# EAGLE schematic BlueBus (EAGLE 9.6.2)

## Sheet 1 of 5
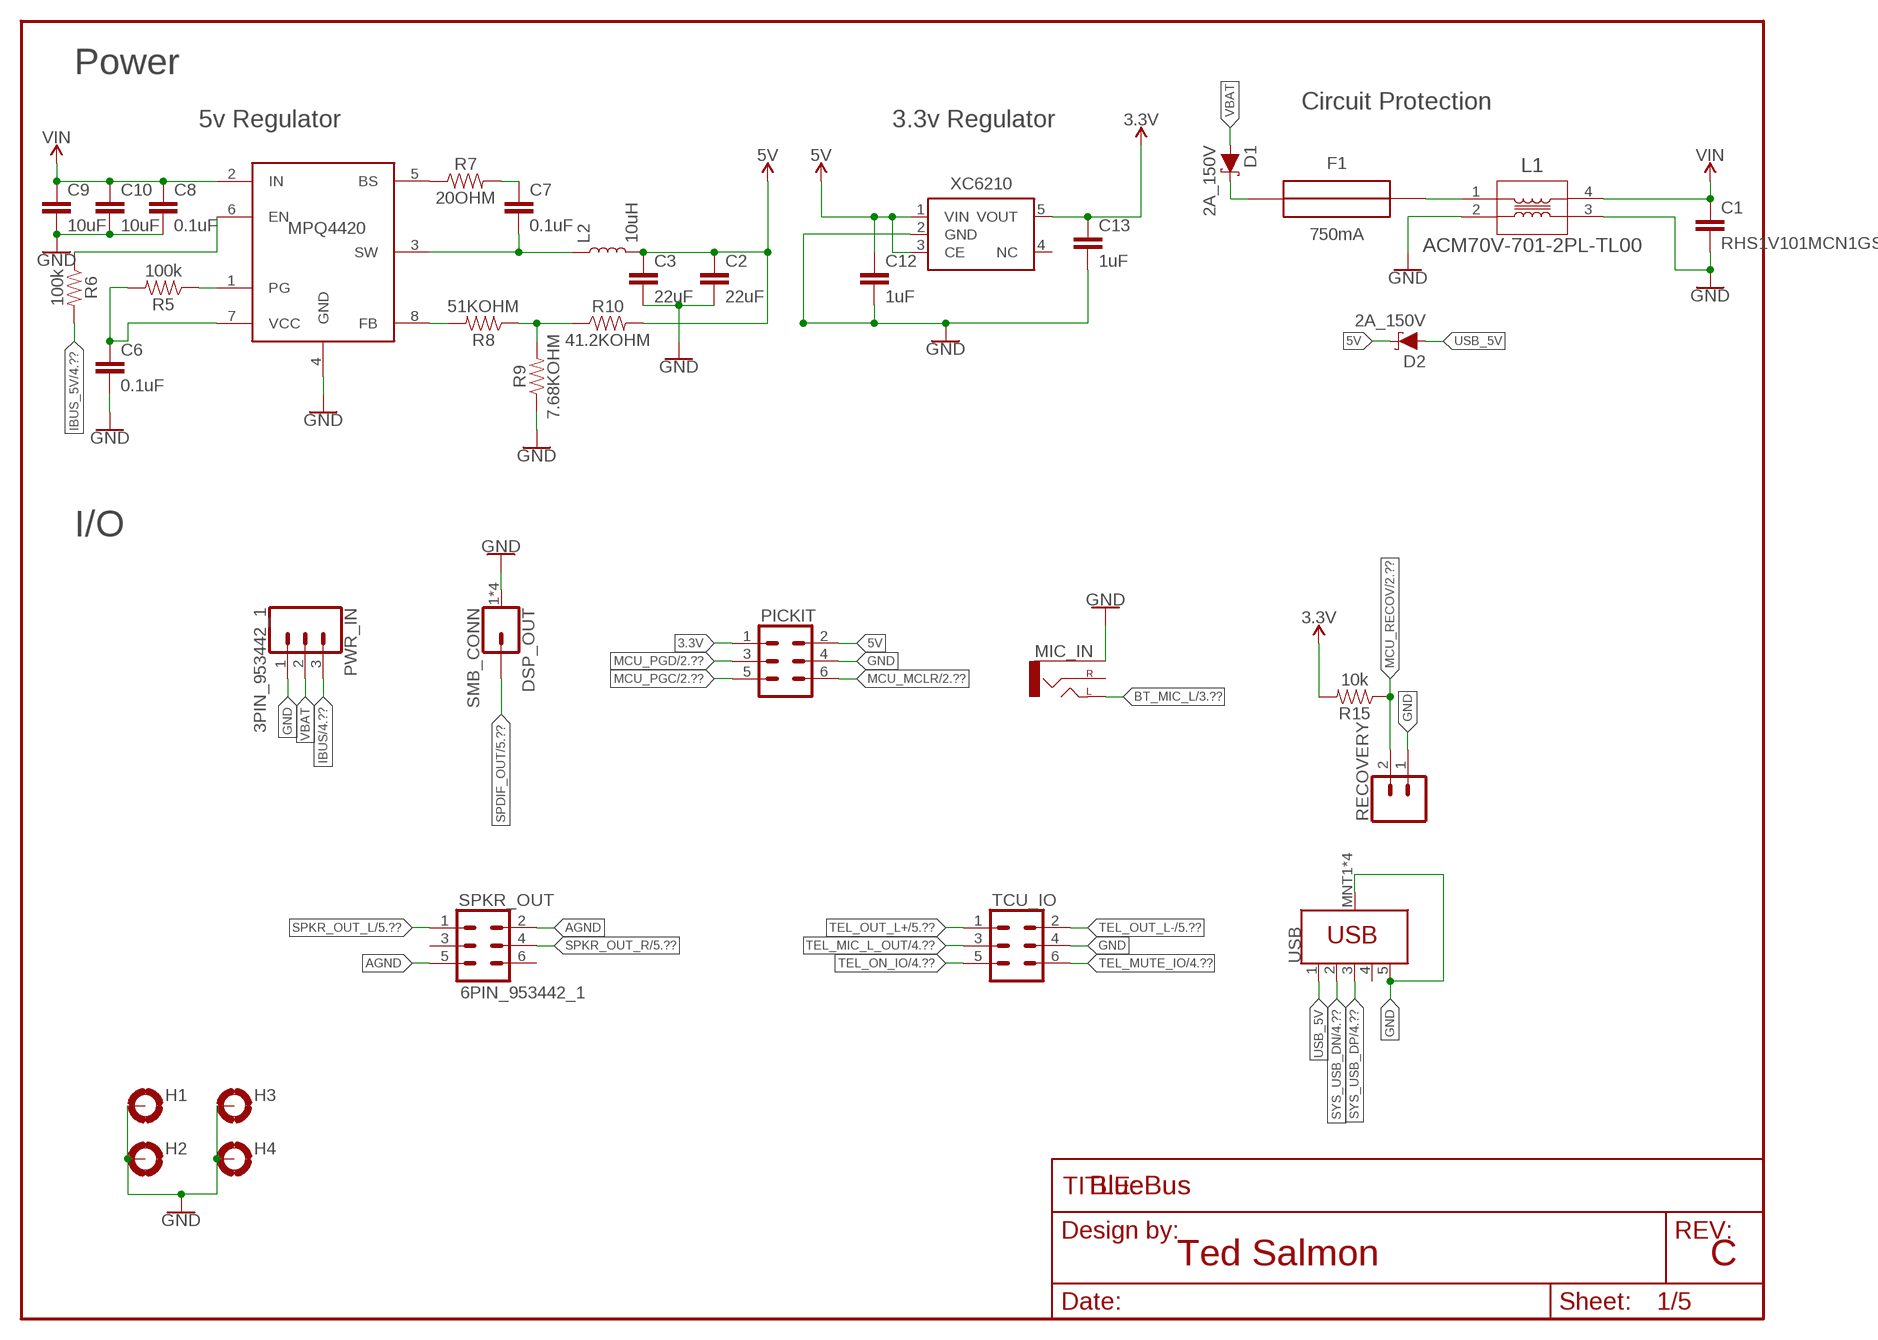
[diagram p0: schematic, sheet 1]

### Parts
C1  RHS1V101MCN1GS  [RHS1V101MCN1GS]
C2  22uF  22UF  [0805]
C3  22uF  22UF  [0805]
C6  0.1uF  0.1UF  [0805]
C7  0.1uF  0.1UF  [0805]
C8  0.1uF  0.1UF  [0805]
C9  10uF  10UF  [1206]
C10  10uF  10UF  [1206]
C12  1uF  1UF  [0805]
C13  1uF  1UF  [0805]
D1  2A_150V  SMD2150PL_2A_150V  [SOD123FL-2]
D2  2A_150V  SMD2150PL_2A_150V  [SOD123FL-2]
DSP_OUT  SMB_CONN  [MOLEX_SMB]
F1  750mA  LITTLEBLOCK_FUSE_.75A  [LITTLEFUSE]
FRAME1  FRAME-LETTER  [DUMMY]
H1  2,2-PAD  [2.2-PAD]
H2  2,2-PAD  [2.2-PAD]
H3  2,2-PAD  [2.2-PAD]
H4  2,2-PAD  [2.2-PAD]
L1  ACM70V-701-2PL-TL00  [ACM70V-701-2PL-TL00]
L2  10uH  MPL-SE5040-100  [MPL-SE5040]
MIC_IN  AUDIO-CUI-SJ-3523-SMT  [AUDIO-CUI-SJ-352X-SMT]
MPQ4420  MPQ4420  [TSOT23-8]
PICKIT  6PIN_JUMPER  [2X3]
PWR_IN  3PIN_953442_1  [TE_MQS_3PIN]
R5  100k  100KOHM  [0805]
R6  100k  100KOHM  [0805]
R7  20OHM  [0805]
R8  51KOHM  [0805]
R9  7.68KOHM  [0805]
R10  41.2KOHM  [0805]
R15  10k  10KOHM  [0805]
RECOVERY  2PIN_JUMPER  [1X02]
SPKR_OUT  6PIN_953442_1  [TE_MQS_6PIN]
TCU_IO  6PIN_5_103166_1  [TE_AMPMODU_6_PIN]
USB  USB3080-30-01-A  [USB3080-30-01-A]
XC6210  XC6210SOT25  [SOT23-5]

### Nets
3.3V [3.3V]: C13.1 PICKIT.1 R15.2 XC6210.5(VOUT) ; also sheet 2,3,4,5
5V [USB_5V]: C2.1 C3.1 C12.1 D2.C L2.2 PICKIT.2 R10.2 XC6210.1(VIN) XC6210.3(CE) ; also sheet 4,5
5VREG_BS: MPQ4420.5(BS) R7.1
5VREG_BS_CAP: C7.1 R7.2
5VREG_EN: MPQ4420.6(EN) R6.1
5VREG_FB: MPQ4420.8(FB) R8.2
5VREG_FB_T: R8.1 R9.2 R10.1
5VREG_PG: MPQ4420.1(PG) R5.1
5VREG_SW: C7.2 L2.1 MPQ4420.3(SW)
5VREG_VCC: C6.1 MPQ4420.7(VCC) R5.2
AGND: SPKR_OUT.2 SPKR_OUT.5 ; also sheet 5
BT_MIC_L: MIC_IN.TIP(LEFT) ; also sheet 3,4
GND: C1.2 C2.2 C3.2 C6.2 C8.2 C9.2 C10.2 C12.2 C13.2 DSP_OUT.1(GND) DSP_OUT.2(GND) DSP_OUT.3(GND) DSP_OUT.4(GND) H1.B2.2(MOUNT) H2.B2.2(MOUNT) H3.B2.2(MOUNT) H4.B2.2(MOUNT) L1.2 L1.3 MIC_IN.SLEEVE MPQ4420.4(GND) PICKIT.4 PWR_IN.1 R9.1 RECOVERY.1 TCU_IO.4 USB.5(GND) USB.MNT1(SHIELD) USB.MNT2(SHIELD) USB.MNT3(SHIELD) USB.MNT4(SHIELD) XC6210.2(GND) ; also sheet 2,3,4,5
IBUS [Data]: PWR_IN.3 ; also sheet 4
IBUS_5V: R6.2 ; also sheet 4
MCU_MCLR [MCU_Data]: PICKIT.6 ; also sheet 2
MCU_PGC [MCU_Data]: PICKIT.5 ; also sheet 2
MCU_PGD [MCU_Data]: PICKIT.3 ; also sheet 2
MCU_RECOV [MCU_Data]: R15.1 RECOVERY.2 ; also sheet 2
SPDIF_OUT: DSP_OUT.P$1 ; also sheet 5
SPKR_OUT_L: SPKR_OUT.1 ; also sheet 5
SPKR_OUT_R: SPKR_OUT.4 ; also sheet 5
SYS_USB_DN [Data]: USB.2(D-) ; also sheet 4
SYS_USB_DP [Data]: USB.3(D+) ; also sheet 4
TEL_MIC_L_OUT: TCU_IO.3 ; also sheet 4
TEL_MUTE_IO: TCU_IO.6 ; also sheet 4
TEL_ON_IO: TCU_IO.5 ; also sheet 4
TEL_OUT_L+: TCU_IO.1 ; also sheet 5
TEL_OUT_L-: TCU_IO.2 ; also sheet 5
USB_5V: D2.A USB.1(VBUS)
VBAT: D1.A PWR_IN.2
VBAT_DIODE: D1.C F1.IN(OUT)
VBAT_FUSE: F1.OUT(IN) L1.1
VIN [VIN]: C1.1 C8.1 C9.1 C10.1 L1.4 MPQ4420.2(IN) ; also sheet 4
Unconnected: MIC_IN.RING(RIGHT) SPKR_OUT.3 SPKR_OUT.6 USB.4(ID) XC6210.4(NC)

### Notes on the sheet
- Power
- Circuit Protection
- 5v Regulator | 3.3v Regulator
- I/O
- Ted Salmon | C

## Sheet 2 of 5
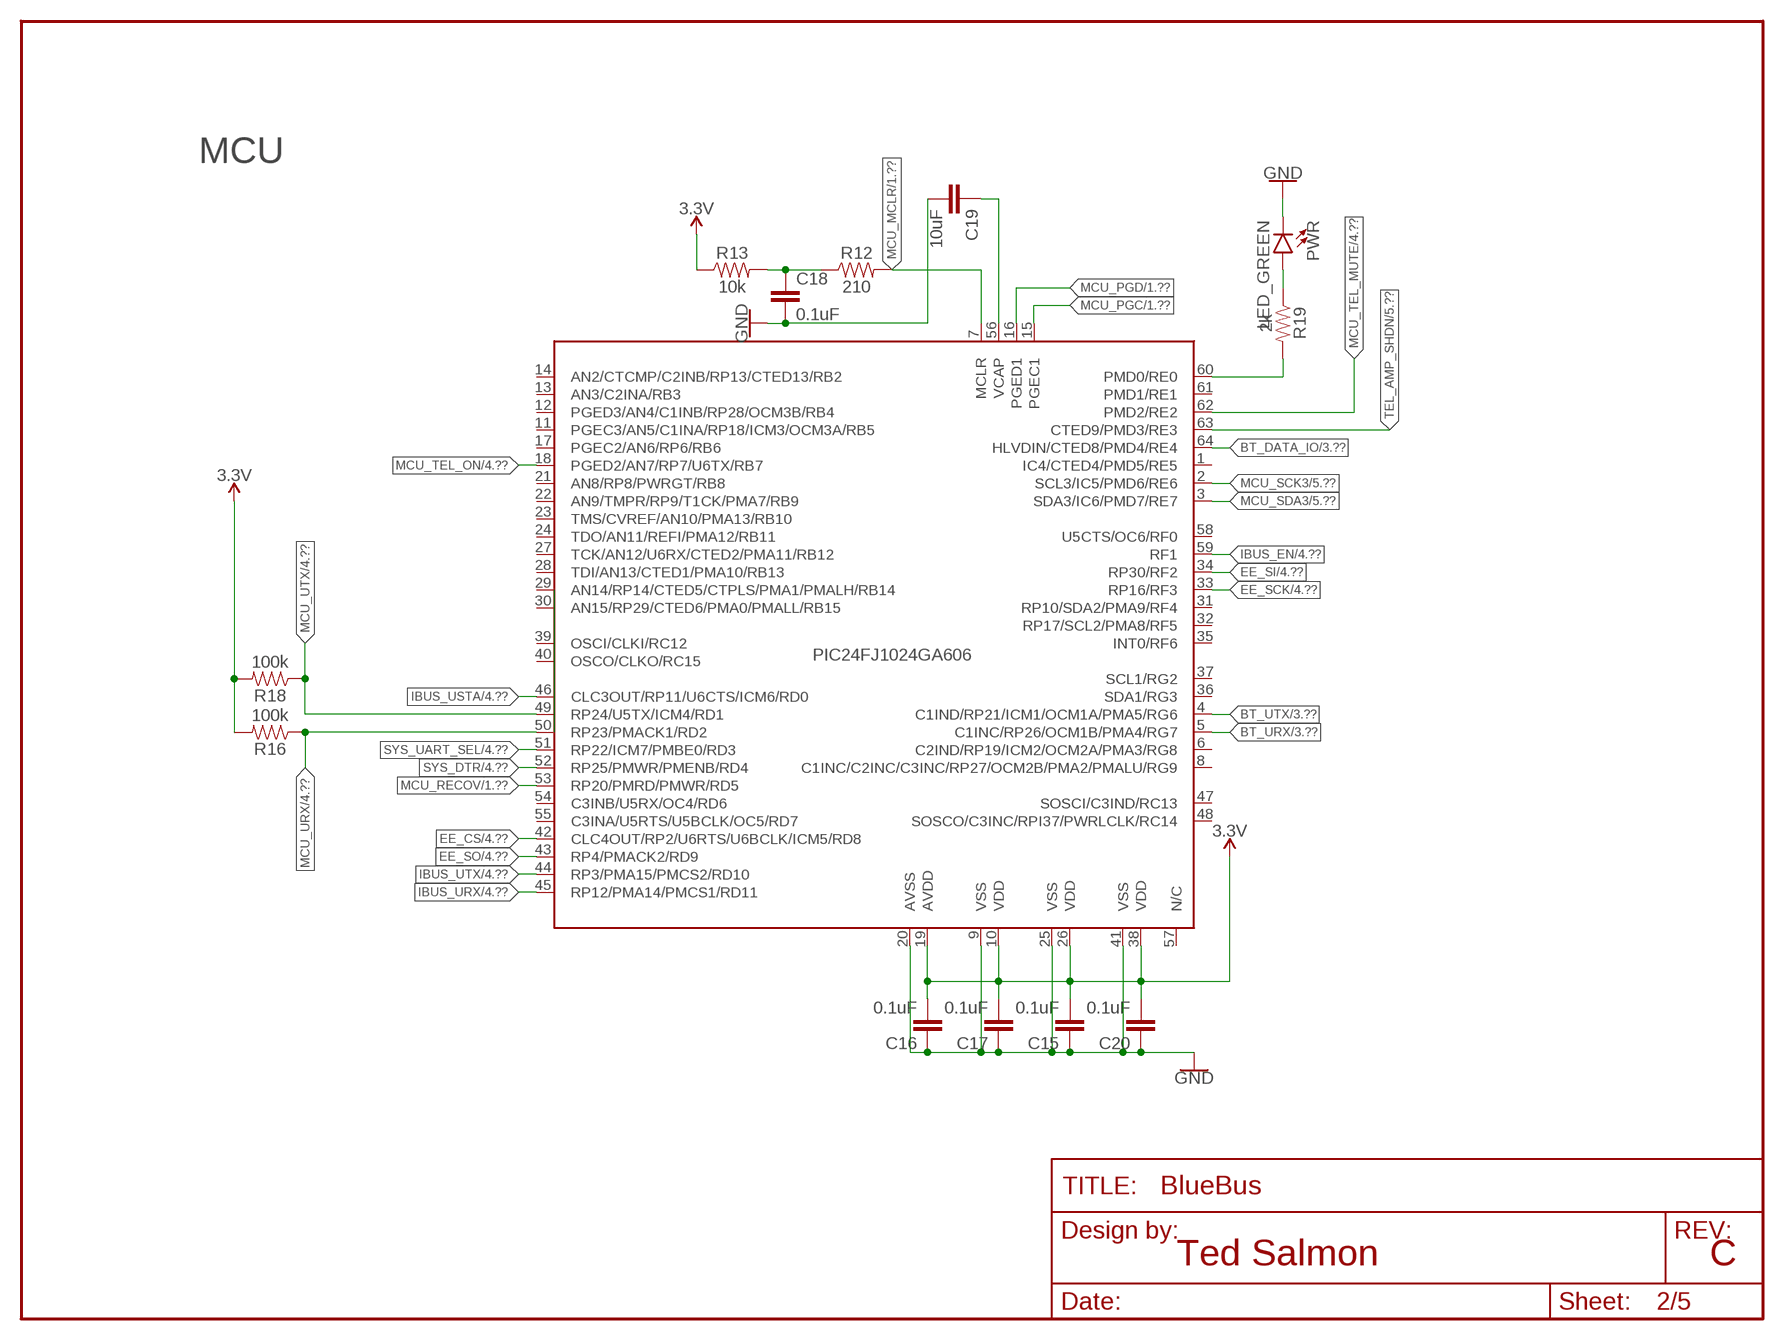
[diagram p1: schematic, sheet 2]

### Parts
C15  0.1uF  0.1UF  [0805]
C16  0.1uF  0.1UF  [0805]
C17  0.1uF  0.1UF  [0805]
C18  0.1uF  0.1UF  [0805]
C19  10uF  10UF2012  [0805]
C20  0.1uF  0.1UF  [0805]
FRAME2  FRAME-LETTER  [DUMMY]
PIC24FJ1024GA606  PIC24FJ1024GA606  [TQFP64]
PWR  LED_GREEN  [LED-0805]
R12  210  210OHM  [0805]
R13  10k  10KOHM  [0805]
R16  100k  100KOHM  [0805]
R18  100k  100KOHM  [0805]
R19  2k  2KOHM  [0805]

### Nets
3.3V [3.3V]: C15.2 C16.2 C17.2 C20.2 PIC24FJ1024GA606.10(VDD) PIC24FJ1024GA606.19(AVDD) PIC24FJ1024GA606.26(VDD) PIC24FJ1024GA606.38(VDD) R13.1 R16.2 R18.2 ; also sheet 1,3,4,5
BT_DATA_IO [MCU_Data]: PIC24FJ1024GA606.64(HLVDIN/CTED8/PMD4/RE4) ; also sheet 3
BT_URX [MCU_Data]: PIC24FJ1024GA606.5(C1INC/RP26/OCM1B/PMA4/RG7) ; also sheet 3,4
BT_UTX [MCU_Data]: PIC24FJ1024GA606.4(C1IND/RP21/ICM1/OCM1A/PMA5/RG6) ; also sheet 3,4
EE_CS [MCU_Data]: PIC24FJ1024GA606.42(CLC4OUT/RP2/U6RTS/U6BCLK/ICM5/RD8) ; also sheet 4
EE_SCK [MCU_Data]: PIC24FJ1024GA606.33(RP16/RF3) ; also sheet 4
EE_SI [MCU_Data]: PIC24FJ1024GA606.34(RP30/RF2) ; also sheet 4
EE_SO [MCU_Data]: PIC24FJ1024GA606.43(RP4/PMACK2/RD9) ; also sheet 4
GND: C15.1 C16.1 C17.1 C18.2 C19.2 C20.1 PIC24FJ1024GA606.9(VSS) PIC24FJ1024GA606.20(AVSS) PIC24FJ1024GA606.25(VSS) PIC24FJ1024GA606.41(VSS) PWR.-(C) ; also sheet 1,3,4,5
IBUS_EN [MCU_Data]: PIC24FJ1024GA606.59(RF1) ; also sheet 4
IBUS_URX [MCU_Data]: PIC24FJ1024GA606.45(RP12/PMA14/PMCS1/RD11) ; also sheet 4
IBUS_USTA [MCU_Data]: PIC24FJ1024GA606.46(CLC3OUT/RP11/U6CTS/ICM6/RD0) ; also sheet 4
IBUS_UTX [MCU_Data]: PIC24FJ1024GA606.44(RP3/PMA15/PMCS2/RD10) ; also sheet 4
MCU_MCLR [MCU_Data]: PIC24FJ1024GA606.7(MCLR) R12.2 ; also sheet 1
MCU_MCLR_RES [MCU_Data]: C18.1 R12.1 R13.2
MCU_ON_LED [MCU_Data]: PIC24FJ1024GA606.60(PMD0/RE0) R19.2
MCU_ON_LED_RES: PWR.+(A) R19.1
MCU_PGC [MCU_Data]: PIC24FJ1024GA606.15(PGEC1) ; also sheet 1
MCU_PGD [MCU_Data]: PIC24FJ1024GA606.16(PGED1) ; also sheet 1
MCU_RECOV [MCU_Data]: PIC24FJ1024GA606.53(RP20/PMRD/PMWR/RD5) ; also sheet 1
MCU_SCK3 [MCU_Data]: PIC24FJ1024GA606.2(SCL3/IC5/PMD6/RE6) ; also sheet 5
MCU_SDA3 [MCU_Data]: PIC24FJ1024GA606.3(SDA3/IC6/PMD7/RE7) ; also sheet 5
MCU_TEL_MUTE [MCU_Data]: PIC24FJ1024GA606.62(PMD2/RE2) ; also sheet 4
MCU_TEL_ON [MCU_Data]: PIC24FJ1024GA606.18(PGED2/AN7/RP7/U6TX/RB7) ; also sheet 4
MCU_URX [MCU_Data]: PIC24FJ1024GA606.50(RP23/PMACK1/RD2) R16.1 ; also sheet 4
MCU_UTX [MCU_Data]: PIC24FJ1024GA606.49(RP24/U5TX/ICM4/RD1) R18.1 ; also sheet 4
MCU_VCAP [MCU_Data]: C19.1 PIC24FJ1024GA606.56(VCAP)
SYS_DTR [MCU_Data]: PIC24FJ1024GA606.52(RP25/PMWR/PMENB/RD4) ; also sheet 4
SYS_UART_SEL [MCU_Data]: PIC24FJ1024GA606.51(RP22/ICM7/PMBE0/RD3) ; also sheet 4
TEL_AMP_SHDN [MCU_Data]: PIC24FJ1024GA606.63(CTED9/PMD3/RE3) ; also sheet 5
Unconnected: PIC24FJ1024GA606.1(IC4/CTED4/PMD5/RE5) PIC24FJ1024GA606.6(C2IND/RP19/ICM2/OCM2A/PMA3/RG8) PIC24FJ1024GA606.8(C1INC/C2INC/C3INC/RP27/OCM2B/PMA2/PMALU/RG9) PIC24FJ1024GA606.11(PGEC3/AN5/C1INA/RP18/ICM3/OCM3A/RB5) PIC24FJ1024GA606.12(PGED3/AN4/C1INB/RP28/OCM3B/RB4) PIC24FJ1024GA606.13(AN3/C2INA/RB3) PIC24FJ1024GA606.14(AN2/CTCMP/C2INB/RP13/CTED13/RB2) PIC24FJ1024GA606.17(PGEC2/AN6/RP6/RB6) PIC24FJ1024GA606.21(AN8/RP8/PWRGT/RB8) PIC24FJ1024GA606.22(AN9/TMPR/RP9/T1CK/PMA7/RB9) PIC24FJ1024GA606.23(TMS/CVREF/AN10/PMA13/RB10) PIC24FJ1024GA606.24(TDO/AN11/REFI/PMA12/RB11) PIC24FJ1024GA606.27(TCK/AN12/U6RX/CTED2/PMA11/RB12) PIC24FJ1024GA606.28(TDI/AN13/CTED1/PMA10/RB13) PIC24FJ1024GA606.29(AN14/RP14/CTED5/CTPLS/PMA1/PMALH/RB14) PIC24FJ1024GA606.30(AN15/RP29/CTED6/PMA0/PMALL/RB15) PIC24FJ1024GA606.31(RP10/SDA2/PMA9/RF4) PIC24FJ1024GA606.32(RP17/SCL2/PMA8/RF5) PIC24FJ1024GA606.35(INT0/RF6) PIC24FJ1024GA606.36(SDA1/RG3) PIC24FJ1024GA606.37(SCL1/RG2) PIC24FJ1024GA606.39(OSCI/CLKI/RC12) PIC24FJ1024GA606.40(OSCO/CLKO/RC15) PIC24FJ1024GA606.47(SOSCI/C3IND/RC13) PIC24FJ1024GA606.48(SOSCO/C3INC/RPI37/PWRLCLK/RC14) PIC24FJ1024GA606.54(C3INB/U5RX/OC4/RD6) PIC24FJ1024GA606.55(C3INA/U5RTS/U5BCLK/OC5/RD7) PIC24FJ1024GA606.57(N/C) PIC24FJ1024GA606.58(U5CTS/OC6/RF0) PIC24FJ1024GA606.61(PMD1/RE1)

### Notes on the sheet
- MCU
- Ted Salmon | C

## Sheet 3 of 5
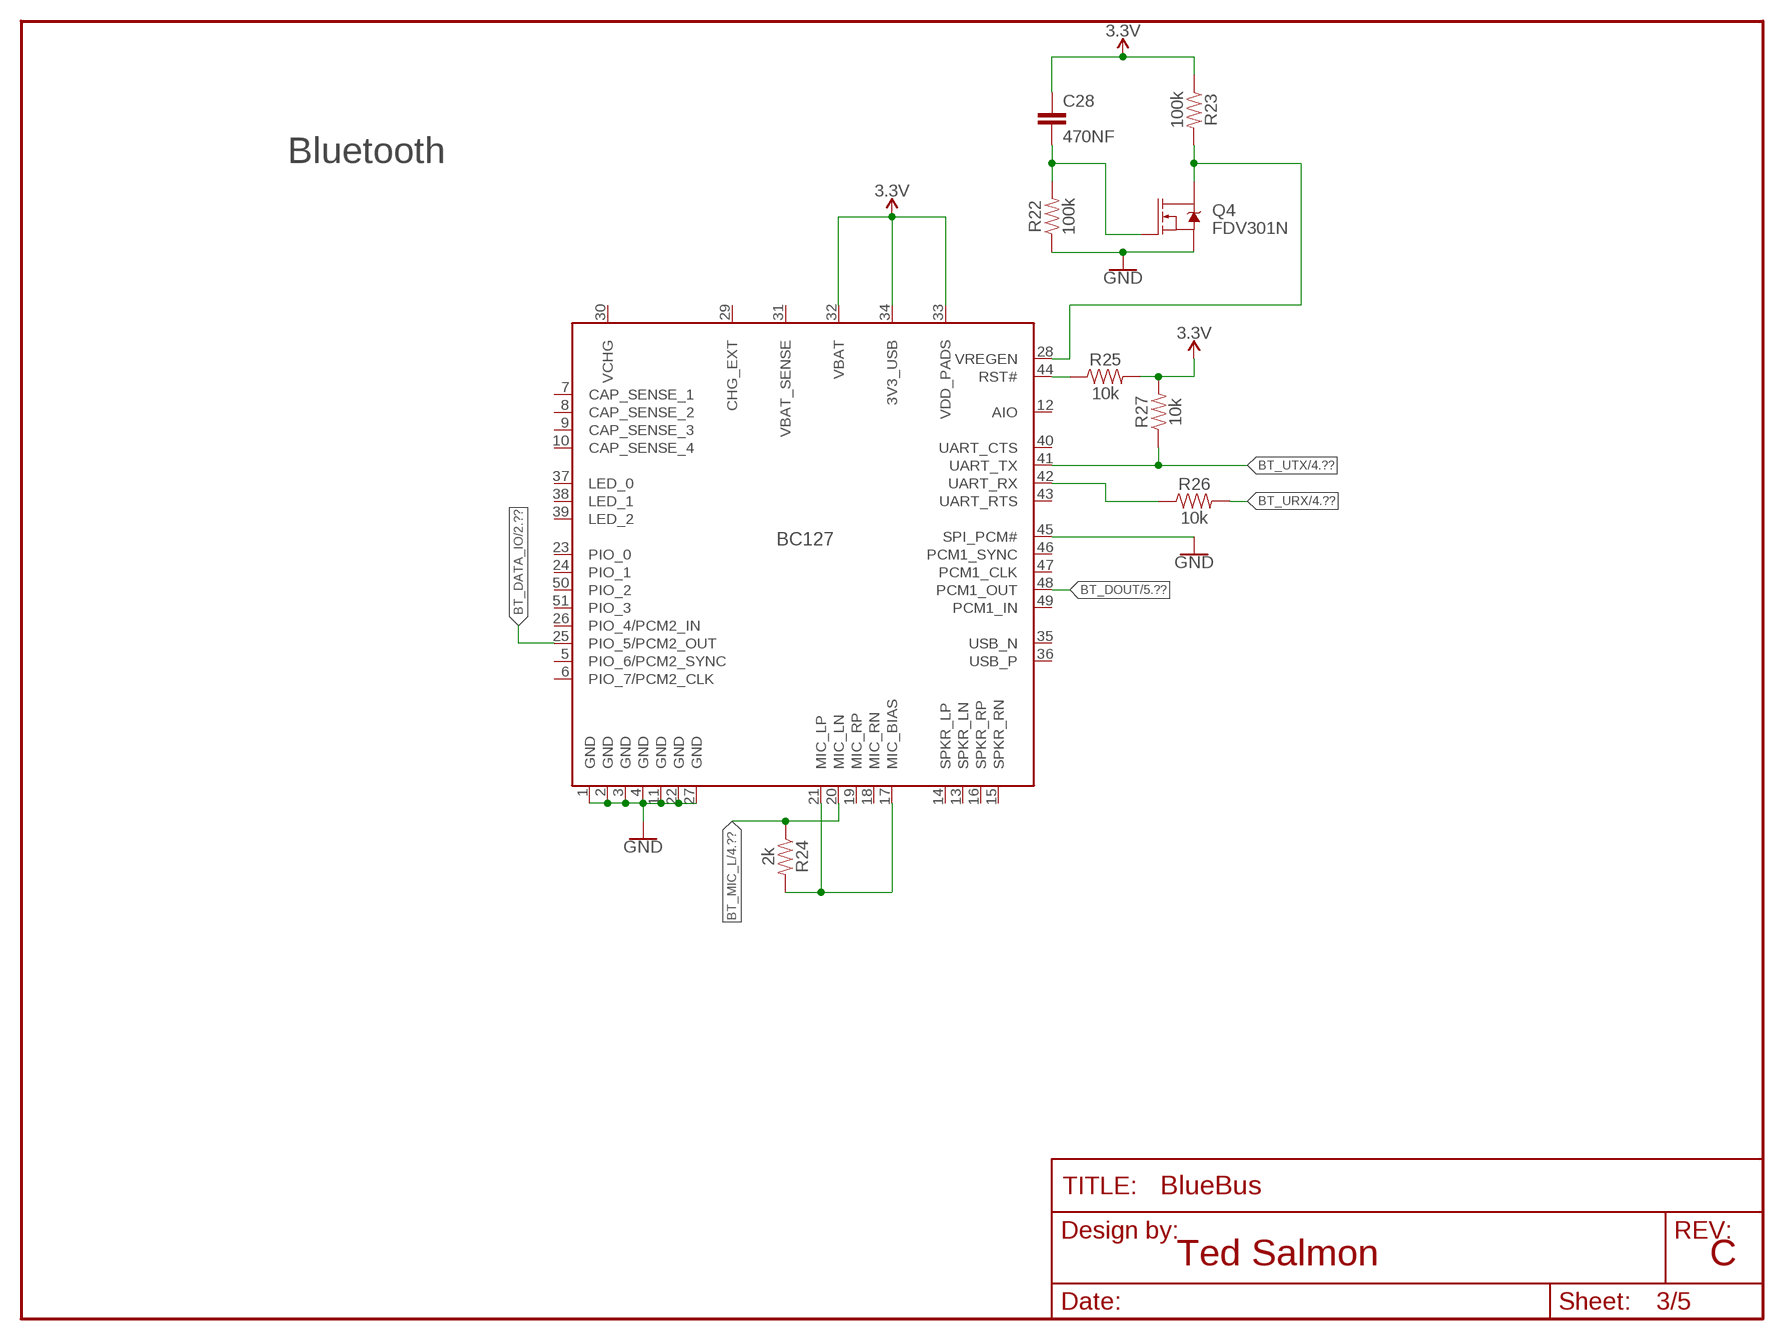
[diagram p2: schematic, sheet 3]

### Parts
BC127  BC127  [BC127]
C28  470NF  [0805]
FRAME4  FRAME-LETTER  [DUMMY]
Q4  FDV301N  [SOT-23]
R22  100k  100KOHM  [0805]
R23  100k  100KOHM  [0805]
R24  2k  2KOHM  [0805]
R25  10k  10KOHM  [0805]
R26  10k  10KOHM  [0805]
R27  10k  10KOHM  [0805]

### Nets
3.3V [3.3V]: BC127.32(VBAT) BC127.33(VDD_PADS) BC127.34(3V3_USB) C28.1 R23.1 R25.2 R27.2 ; also sheet 1,2,4,5
BT_DATA_IO [MCU_Data]: BC127.25(PIO_5/PCM2_OUT) ; also sheet 2
BT_DOUT: BC127.48(PCM1_OUT) ; also sheet 5
BT_MIC_BIAS: BC127.17(MIC_BIAS) BC127.21(MIC_LP) R24.2
BT_MIC_L: BC127.20(MIC_LN) R24.1 ; also sheet 1,4
BT_RST: BC127.44(RST#) R25.1
BT_URX [MCU_Data]: R26.2 ; also sheet 2,4
BT_URX_RES [MCU_Data]: BC127.42(UART_RX) R26.1
BT_UTX [MCU_Data]: BC127.41(UART_TX) R27.1 ; also sheet 2,4
BT_VREGEN: BC127.28(VREGEN) Q4.3(D) R23.2
BT_VREGEN_CAP_GATE: C28.2 Q4.1(G) R22.2
GND: BC127.1(GND) BC127.2(GND) BC127.3(GND) BC127.4(GND) BC127.11(GND) BC127.22(GND) BC127.27(GND) BC127.45(SPI_PCM#) Q4.2(S) R22.1 ; also sheet 1,2,4,5
Unconnected: BC127.5(PIO_6/PCM2_SYNC) BC127.6(PIO_7/PCM2_CLK) BC127.7(CAP_SENSE_1) BC127.8(CAP_SENSE_2) BC127.9(CAP_SENSE_3) BC127.10(CAP_SENSE_4) BC127.12(AIO) BC127.13(SPKR_LN) BC127.14(SPKR_LP) BC127.15(SPKR_RN) BC127.16(SPKR_RP) BC127.18(MIC_RN) BC127.19(MIC_RP) BC127.23(PIO_0) BC127.24(PIO_1) BC127.26(PIO_4/PCM2_IN) BC127.35(USB_N) BC127.36(USB_P) BC127.37(LED_0) BC127.38(LED_1) BC127.39(LED_2) BC127.40(UART_CTS) BC127.43(UART_RTS) BC127.46(PCM1_SYNC) BC127.47(PCM1_CLK) BC127.49(PCM1_IN) BC127.50(PIO_2) BC127.51(PIO_3)

### Notes on the sheet
- Bluetooth
- Ted Salmon | C

## Sheet 4 of 5
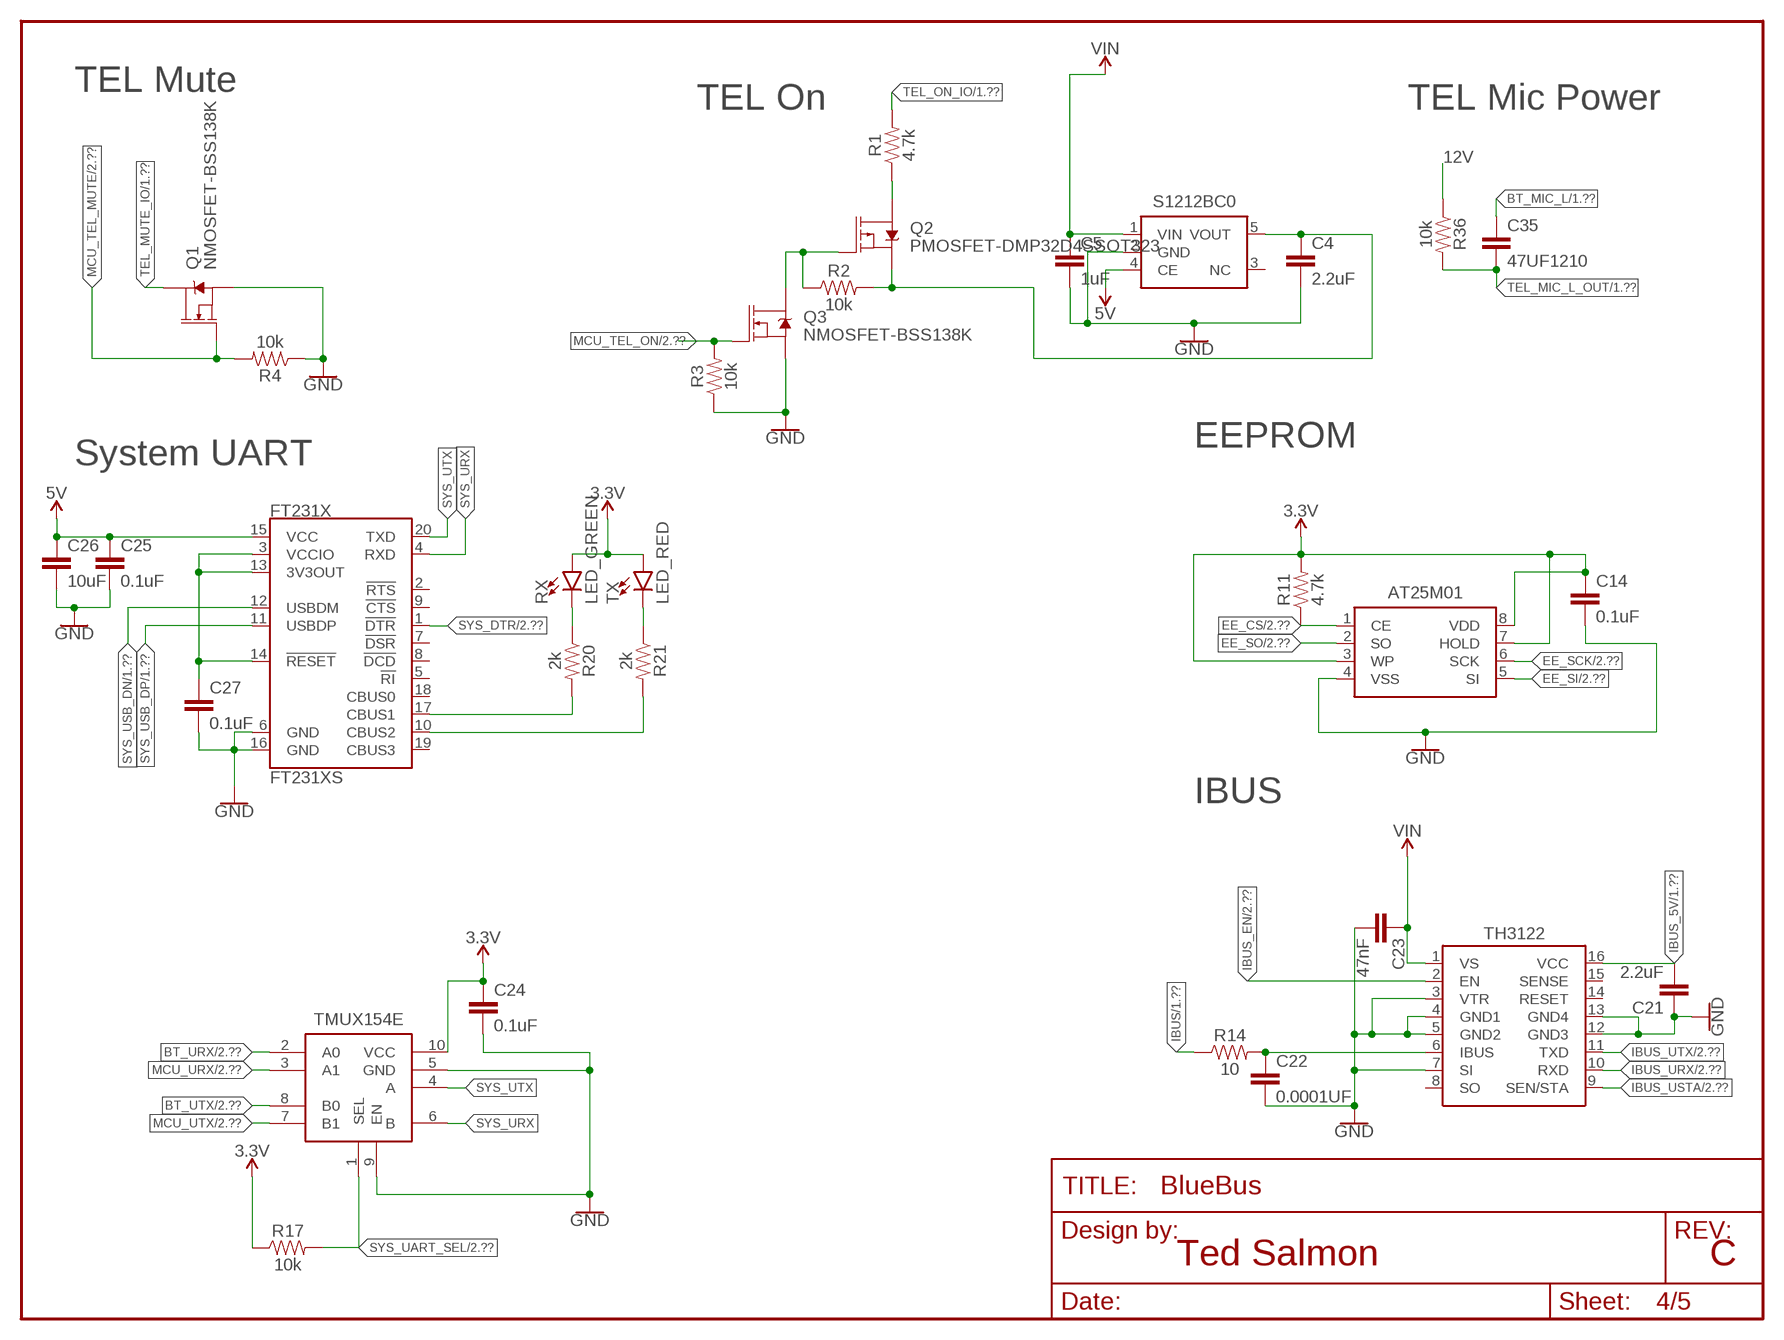
[diagram p3: schematic, sheet 4]

### Parts
AT25M01  AT25M01-SHM  [SOIJ-8]
C4  2.2uF  2.2UF  [0805]
C5  1uF  1UF  [0805]
C14  0.1uF  0.1UF  [0805]
C21  2.2uF  2.2UF  [0805]
C22  0.0001UF  [0805]
C23  47nF  47NF  [0805]
C24  0.1uF  0.1UF  [0805]
C25  0.1uF  0.1UF  [0805]
C26  10uF  10UF2012  [0805]
C27  0.1uF  0.1UF  [0805]
C35  47UF1210  [1210]
FRAME3  FRAME-LETTER  [DUMMY]
FT231X  FT231XS  [SSOP20_L]
Q1  NMOSFET-BSS138K  [SOT-23]
Q2  PMOSFET-DMP32D4SSOT323  [SOT323]
Q3  NMOSFET-BSS138K  [SOT-23]
R1  4.7k  4.7KOHM  [0805]
R2  10k  10KOHM  [0805]
R3  10k  10KOHM  [0805]
R4  10k  10KOHM  [0805]
R11  4.7k  4.7KOHM  [0805]
R14  10  10OHM  [0805]
R17  10k  10KOHM  [0805]
R20  2k  2KOHM  [0805]
R21  2k  2KOHM  [0805]
R36  10k  10KOHM  [0805]
RX  LED_GREEN  [LED-0805]
S1212BC0  S-1212BC0-M5T1U  [SOT23-5]
TH3122  TH3122.4  [SOIC16DF]
TMUX154E  TMUX154E  [VSSOP10]
TX  LED_RED  [LED-0805]

### Nets
3.3V [3.3V]: AT25M01.3(WP) AT25M01.7(HOLD) AT25M01.8(VDD) C14.1 C24.1 R11.2 R17.1 RX.+(A) TMUX154E.10(VCC) TX.+(A) ; also sheet 1,2,3,5
5V [USB_5V]: C25.1 C26.1 FT231X.15(VCC) S1212BC0.4(CE) ; also sheet 1,5
12V [VIN]: C4.1 Q2.2(S) R2.2 R36.1 S1212BC0.5(VOUT)
BT_MIC_L: C35.1 ; also sheet 1,3
BT_URX [MCU_Data]: TMUX154E.2(A0) ; also sheet 2,3
BT_UTX [MCU_Data]: TMUX154E.8(B0) ; also sheet 2,3
EE_CS [MCU_Data]: AT25M01.1(CE) R11.1 ; also sheet 2
EE_SCK [MCU_Data]: AT25M01.6(SCK) ; also sheet 2
EE_SI [MCU_Data]: AT25M01.5(SI) ; also sheet 2
EE_SO [MCU_Data]: AT25M01.2(SO) ; also sheet 2
GND: AT25M01.4(VSS) C4.2 C5.2 C14.2 C21.1 C22.2 C23.2 C24.2 C25.2 C26.2 C27.2 FT231X.6(GND) FT231X.16(GND) Q1.2(S) Q3.2(S) R3.1 R4.1 S1212BC0.2(GND) TH3122.3(VTR) TH3122.4(GND1) TH3122.5(GND2) TH3122.7(SI) TH3122.12(GND3) TH3122.13(GND4) TMUX154E.5(GND) TMUX154E.9(EN) ; also sheet 1,2,3,5
IBUS [Data]: R14.1 ; also sheet 1
IBUS_5V: C21.2 TH3122.16(VCC) ; also sheet 1
IBUS_EN [MCU_Data]: TH3122.2(EN) ; also sheet 2
IBUS_FILT: C22.1 R14.2 TH3122.6(IBUS)
IBUS_URX [MCU_Data]: TH3122.10(RXD) ; also sheet 2
IBUS_USTA [MCU_Data]: TH3122.9(SEN/STA) ; also sheet 2
IBUS_UTX [MCU_Data]: TH3122.11(TXD) ; also sheet 2
MCU_TEL_MUTE [MCU_Data]: Q1.1(G) R4.2 ; also sheet 2
MCU_TEL_ON [MCU_Data]: Q3.1(G) R3.2 ; also sheet 2
MCU_URX [MCU_Data]: TMUX154E.3(A1) ; also sheet 2
MCU_UTX [MCU_Data]: TMUX154E.7(B1) ; also sheet 2
SYS_DTR [MCU_Data]: FT231X.1(!DTR) ; also sheet 2
SYS_RX_LED: FT231X.17(CBUS1) R20.2
SYS_RX_LED_RES: R20.1 RX.-(C)
SYS_TX_LED: FT231X.10(CBUS2) R21.2
SYS_TX_LED_RES: R21.1 TX.-(C)
SYS_UART_SEL [MCU_Data]: R17.2 TMUX154E.1(SEL) ; also sheet 2
SYS_URX: FT231X.4(RXD) TMUX154E.6(B)
SYS_USB_DN [Data]: FT231X.12(USBDM) ; also sheet 1
SYS_USB_DP [Data]: FT231X.11(USBDP) ; also sheet 1
SYS_UTX: FT231X.20(TXD) TMUX154E.4(A)
TEL_MIC_L_OUT: C35.2 R36.2 ; also sheet 1
TEL_MUTE_IO: Q1.3(D) ; also sheet 1
TEL_ON: Q2.3(D) R1.1
TEL_ON_EN: Q2.1(G) Q3.3(D) R2.1
TEL_ON_IO: R1.2 ; also sheet 1
USB_3V3: C27.1 FT231X.3(VCCIO) FT231X.13(3V3OUT) FT231X.14(!RESET)
VIN [VIN]: C5.1 C23.1 S1212BC0.1(VIN) TH3122.1(VS) ; also sheet 1
Unconnected: FT231X.2(!RTS) FT231X.5(!RI) FT231X.7(!DSR) FT231X.8(!DCD) FT231X.9(!CTS) FT231X.18(CBUS0) FT231X.19(CBUS3) S1212BC0.3(NC) TH3122.8(SO) TH3122.14(RESET) TH3122.15(SENSE)

### Notes on the sheet
- TEL Mute
- TEL On | TEL Mic Power
- EEPROM
- System UART
- IBUS
- Ted Salmon | C

## Sheet 5 of 5
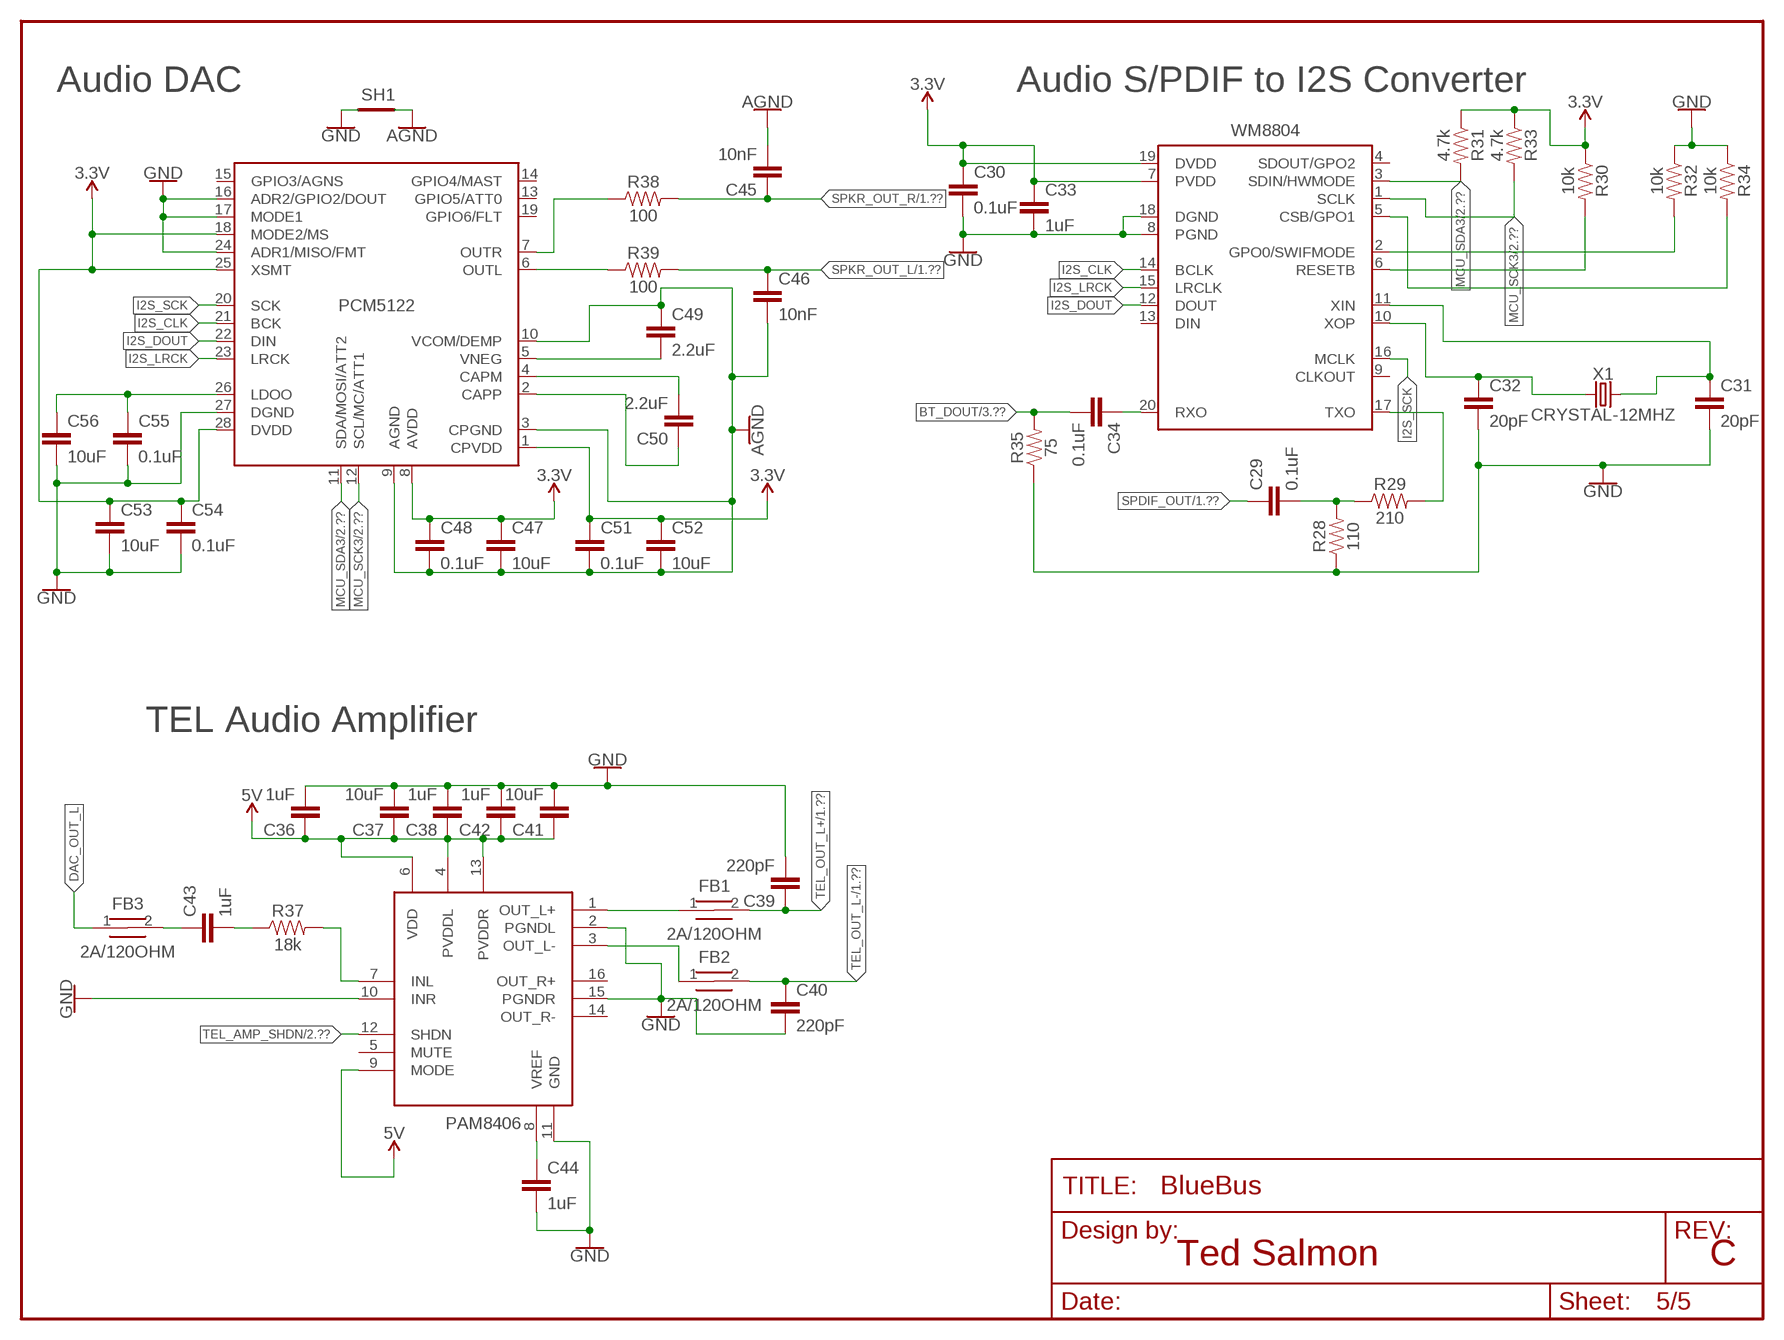
[diagram p4: schematic, sheet 5]

### Parts
C29  0.1uF  0.1UF  [0805]
C30  0.1uF  0.1UF  [0805]
C31  20pF  20PF  [0805]
C32  20pF  20PF  [0805]
C33  1uF  1UF  [0805]
C34  0.1uF  0.1UF  [0805]
C36  1uF  1UF  [0805]
C37  10uF  10UF2012  [0805]
C38  1uF  1UF  [0805]
C39  220pF  220PF  [0805]
C40  220pF  220PF  [0805]
C41  10uF  10UF2012  [0805]
C42  1uF  1UF  [0805]
C43  1uF  1UF  [0805]
C44  1uF  1UF  [0805]
C45  10nF  10NF  [0805]
C46  10nF  10NF  [0805]
C47  10uF  10UF2012  [0805]
C48  0.1uF  0.1UF  [0805]
C49  2.2uF  2.2UF  [0805]
C50  2.2uF  2.2UF  [0805]
C51  0.1uF  0.1UF  [0805]
C52  10uF  10UF2012  [0805]
C53  10uF  10UF2012  [0805]
C54  0.1uF  0.1UF  [0805]
C55  0.1uF  0.1UF  [0805]
C56  10uF  10UF2012  [0805]
FB1  2A/120OHM  FERRITE_2A/120OHM  [0805]
FB2  2A/120OHM  FERRITE_2A/120OHM  [0805]
FB3  2A/120OHM  FERRITE_2A/120OHM  [0805]
FRAME5  FRAME-LETTER  [DUMMY]
PAM8406  PAM8406  [SOP-16]
PCM5122  PCM5122  [TSSOP28]
R28  110  110OHM  [0805]
R29  210  210OHM  [0805]
R30  10k  10KOHM  [0805]
R31  4.7k  4.7KOHM  [0805]
R32  10k  10KOHM  [0805]
R33  4.7k  4.7KOHM  [0805]
R34  10k  10KOHM  [0805]
R35  75  75OHM  [0805]
R37  18k  18KOHM  [0805]
R38  100  100OHM  [0805]
R39  100  100OHM  [0805]
SH1  SHORTT5  [SHORT_TOP-50]
WM8804  WM8804  [SSOP20]
X1  CRYSTAL-12MHZ  [HC49]

### Nets
3.3V [3.3V]: C30.1 C33.1 C47.1 C48.1 C51.1 C52.1 C53.1 C54.1 PCM5122.1(CPVDD) PCM5122.8(AVDD) PCM5122.18(MODE2/MS) PCM5122.25(XSMT) PCM5122.28(DVDD) R30.1 R31.1 R33.1 WM8804.7(PVDD) WM8804.19(DVDD) ; also sheet 1,2,3,4
5V [USB_5V]: C36.1 C37.1 C38.1 C41.1 C42.1 PAM8406.4(PVDDL) PAM8406.6(VDD) PAM8406.9(MODE) PAM8406.13(PVDDR) ; also sheet 1,4
AGND: C45.2 C46.2 C47.2 C48.2 C49.1 C51.2 C52.2 PCM5122.3(CPGND) PCM5122.9(AGND) PCM5122.10(VCOM/DEMP) SH1.2 ; also sheet 1
BT_DOUT: C34.2 R35.2 ; also sheet 3
DAC_CAPM: C50.2 PCM5122.4(CAPM)
DAC_CAPP: C50.1 PCM5122.2(CAPP)
DAC_LDOO: C55.1 C56.1 PCM5122.26(LDOO)
DAC_OUT_L: FB3.1 PCM5122.6(OUTL) R39.1
DAC_OUT_R: PCM5122.7(OUTR) R38.1
DAC_VNEG: C49.2 PCM5122.5(VNEG)
GND: C30.2 C31.2 C32.2 C33.2 C36.2 C37.2 C38.2 C39.2 C40.2 C41.2 C42.2 C44.2 C53.2 C54.2 C55.2 C56.2 PAM8406.2(PGNDL) PAM8406.10(INR) PAM8406.11(GND) PAM8406.15(PGNDR) PCM5122.16(ADR2/GPIO2/DOUT) PCM5122.17(MODE1) PCM5122.24(ADR1/MISO/FMT) PCM5122.27(DGND) R28.1 R32.1 R34.1 R35.1 SH1.1 WM8804.8(PGND) WM8804.18(DGND) ; also sheet 1,2,3,4
I2S_CLK: PCM5122.21(BCK) WM8804.14(BCLK)
I2S_DOUT: PCM5122.22(DIN) WM8804.12(DOUT)
I2S_LRCK: PCM5122.23(LRCK) WM8804.15(LRCLK)
I2S_SCK: PCM5122.20(SCK) WM8804.16(MCLK)
MCU_SCK3 [MCU_Data]: PCM5122.12(SCL/MC/ATT1) R33.2 WM8804.1(SCLK) ; also sheet 2
MCU_SDA3 [MCU_Data]: PCM5122.11(SDA/MOSI/ATT2) R31.2 WM8804.3(SDIN/HWMODE) ; also sheet 2
SPDIF_OUT: C29.1 ; also sheet 1
SPDIF_RX: C34.1 WM8804.20(RXO)
SPKR_OUT_L: C46.1 R39.2 ; also sheet 1
SPKR_OUT_R: C45.1 R38.2 ; also sheet 1
TEL_AMP_IN: C43.1 FB3.2
TEL_AMP_INL: PAM8406.7(INL) R37.2
TEL_AMP_INL_CAP_RES: C43.2 R37.1
TEL_AMP_OUT_L+: FB1.1 PAM8406.1(OUT_L+)
TEL_AMP_OUT_L-: FB2.1 PAM8406.3(OUT_L-)
TEL_AMP_SHDN [MCU_Data]: PAM8406.12(SHDN) ; also sheet 2
TEL_AMP_VREF: C44.1 PAM8406.8(VREF)
TEL_OUT_L+: C39.1 FB1.2 ; also sheet 1
TEL_OUT_L-: C40.1 FB2.2 ; also sheet 1
WM_CSB: R34.2 WM8804.5(CSB/GPO1)
WM_GPO0: R32.2 WM8804.2(GPO0/SWIFMODE)
WM_RESETB: R30.2 WM8804.6(RESETB)
WM_SPDIF_TX_RES: R29.2 WM8804.17(TXO)
WM_SPDIF_TX_RES2: C29.2 R28.2 R29.1
WM_XIN: C31.1 WM8804.11(XIN) X1.2
WM_XOP: C32.1 WM8804.10(XOP) X1.1
Unconnected: PAM8406.5(MUTE) PAM8406.14(OUT_R-) PAM8406.16(OUT_R+) PCM5122.13(GPIO5/ATT0) PCM5122.14(GPIO4/MAST) PCM5122.15(GPIO3/AGNS) PCM5122.19(GPIO6/FLT) WM8804.4(SDOUT/GPO2) WM8804.9(CLKOUT) WM8804.13(DIN)

### Notes on the sheet
- Audio DAC | Audio S/PDIF to I2S Converter
- TEL Audio Amplifier
- Ted Salmon | C

## Power pins joined to a net without a drawn wire
CHG_EXT: BC127.29(CHG_EXT)
VBAT_SENSE: BC127.31(VBAT_SENSE)
VCHG: BC127.30(VCHG)

## Library data of the parts
AT25M01 = ICs:AT25M01-SHM
BC127 = ICs:BC127
C1 = Passives:RHS1V101MCN1GS; MFG: Nichicon; PN: RHS1V101MCN1GS
C2 C3 = Passives:22UF; DEVICE: 22uF-0805-6.3v-10%; MFG: TDK; PACKAGE: 0805; PN: C2012X5R0J226K125AB
C4 C21 C49 C50 = Passives:2.2UF: 2.2uF Capacitor; DEVICE: 2.2uF-0805-25V-10%; MFG: TDK; PACKAGE: 0805; PN: CGB4B1X5R1E225K055AC
C5 C12 C13 C33 C36 C38 C42-C44 = Passives:1UF; DEVICE: 1uF-0805-50v-10%; MFG: TDK; PACKAGE: 0805; PN: CGA4J3X7R1H105K125AB
C6-C8 C14-C18 C20 C24 C25 C27 C29 C30 C34 C48 C51 C54 C55 = Passives:0.1UF: 0.1uF capacitor; DEVICE: 0.1uF-0805-50V; MFG: KEMET; PACKAGE: 0805; PN: C0805C104J5RACAUTO
C9 C10 = Passives:10UF: 10uF Capacitor 1206 Package; DEVICE: 10UF-1206-50V-10%; MFG: TDK; PACKAGE: 1206; PN: CGA5L3X5R1H106K160AB
C19 C26 C37 C41 C47 C52 C53 C56 = Passives:10UF: 10uF Capacitor 1206 Package; DEVICE: 10UF-0805-35V-10%; MFG: TDK; PACKAGE: 0805; PN: C2012X5R1V106K125AC
C22 = Passives:0.0001UF: 100pF Capacitor
C23 = Passives:47NF; DEVICE: 47NF-0805-25V; MFG: AVX; PACKAGE: 0805; PN: 08053C473KAT4A
C28 = Passives:470NF; MFG: TDK; PN: CGA4J2X7R1E474K125AA
C31 C32 = Passives:20PF; DEVICE: 20pF-0805-50v-5%; PACKAGE: 0805; PN: C0805X200J5GAC7800
C35 = Passives:47UF: 47uF Capacitor
C39 C40 = Passives:220PF; DEVICE: 220PF-0805-50V-5%; MFG: KEMET; PACKAGE: 0805; PN: C0805X221J5HACAUTO
C45 C46 = Passives:10NF; DEVICE: 10NF-0805-50V; MFG: KEMET; PACKAGE: 0805; PN: C0805C103J5GEC7210
D1 D2 = Passives:SMD2150PL_2A_150V; MFG: MCC
DSP_OUT = Connectors:SMB_CONN
F1 = Passives:LITTLEBLOCK_FUSE_.75A: Littlefuse 154 Series Omni-BLOK Fuse; MFG: LITTLEBLOCK; PN: 0154.750DRT
FB1-FB3 = Passives:FERRITE_2A/120OHM; MFG: BOURNS; PN: MH2029-121Y
FRAME1-FRAME5 = Frame:FRAME-LETTER: Schematic Frame - Letter Standard 8.5x11 US Letter frame
FT231X = ICs:FT231X: FTDI FT231X Full Speed USB to Full-handshake UART
H1-H4 = Connectors:2,2-PAD: 2.2mm Hole
L1 = Passives:ACM70V-701-2PL-TL00; MFG: TDK; PN: ACM70V-701-2PL-TL00
L2 = Passives:MPL-SE5040-100; MFG: MPS; PN: MPL-SE5040-100
MIC_IN = Connectors:AUDIO-CUI-SJ-3523-SMT
MPQ4420 = ICs:MPQ4420
PAM8406 = ICs:PAM8406
PCM5122 = ICs:PCM5122: The PCM512x devices are a family of monolithic CMOS-integrated circuits that include a stereo digitalto-analog converter and additional support circuitry in a small TSSOP package. The PCM512x uses the latest generation of TI’s advanced segment-DAC architecture to achieve excellent dynamic performance and improved tolerance to clock jitter. Members of the PCM512x family integrate preset audio processing functions with programmable coefficients, allowing developers to change the characteristics of the interpolation filter, speaker EQ, dynamic range controls, and average volume control in their products. The PCM512x provides 2.1-VRMS ground-centered outputs, allowing designers to eliminate DC-blocking capacitors on the output, as well as external muting circuits traditionally associated with single supply line drivers. The integrated line driver surpasses all other chargepump-based line drivers by supporting loads down to 1 kΩ. By supporting loads down to 1 kΩ, the PCM512x can essentially drive up to 10 products in parallel (LCD TV, DVDR, AV receivers, and so forth). The integrated PLL on the device removes the requirement for a system clock (commonly known as master clock), allowing a 3-wire I 2S connection, along with reducing system EMI.
PIC24FJ1024GA606 = ICs:PIC24FJ1024GA606
PICKIT = Connectors:6PIN_JUMPER
PWR RX = Passives:LED_GREEN: 0805 Green LED
PWR_IN = Connectors:3PIN_953442_1
Q1 Q3 = Passives:NMOSFET-BSS138K
Q2 = Passives:PMOSFET-DMP32D4S
Q4 = Passives:FDV301N
R1 R11 R31 R33 = Passives:4.7KOHM; DEVICE: 4.7kOHM-0805-1/8-1%; MFG: Panasonic; PACKAGE: 0805; PN: ERJ-6ENF4701V
R2-R4 R13 R15 R17 R25-R27 R30 R32 R34 R36 = Passives:10KOHM: 10K Ohm Resistor; DEVICE: 10KOHM-0805-1/8-1%; MFG: Panasonic; PACKAGE: 0805; PN: ERJ-6ENF1002V
R5 R6 R16 R18 R22 R23 = Passives:100KOHM: 100k Ohm Resistor; DEVICE: 100KOHM-0805-1/8-1%; PN: ERJ-6ENF1003V
R7 = Passives:20OHM
R8 = Passives:51KOHM
R9 = Passives:7.68KOHM
R10 = Passives:41.2KOHM
R12 R29 = Passives:210OHM
R14 = Passives:10OHM; DEVICE: 10OHM-0805-1/8-1%; MFG: Panasonic; PACKAGE: 0805; PN: ERJ-S06F10R0V
R19-R21 R24 = Passives:2KOHM: 2K Ohm Resistor; DEVICE: 2KOHM-0805-.4-1%; MFG: ROHM; PACKAGE: 0805; PN: ESR10EZPF2001
R28 = Passives:110OHM
R35 = Passives:75OHM; DEVICE: 75OHM-0805-1/2-1%; MFG: Panasonic; PN: ERJ-P06F75R0V
R37 = Passives:18KOHM; DEVICE: 18KOHM-0805-1/8-1%; MFG: Panasonic; PACKAGE: 0805; PN: ERJ-6ENF1802V
R38 R39 = Passives:100OHM; MFG: PANASONIC; PN: ERA-6AED101V
RECOVERY = Connectors:2PIN_JUMPER
S1212BC0 = ICs:S-1212BC0-M5T1U
SH1 = shorts:SHORT: Short between two nets; BOM: no
SPKR_OUT = Connectors:6PIN_953442_1: TE Conenctivity 953442-1 6-pin Header with Pinholes
TCU_IO = Connectors:6PIN_5_103166_1
TH3122 = ICs:TH3122.4: The TH3122 consists of a low drop voltage regulator 5V/100mA and a K-Bus transceiver. The transceiver is suitable for K-Bus systems conform to ISO 9141.
TMUX154E = ICs:TMUX154E: TMUX154E
TX = Passives:LED_RED: 0805 Red LED
USB = Connectors:USB3080-30-01-A; MFG: GCT
WM8804 = ICs:WM8804: S/PDIF Transciever Supply Voltage Range: 2.7V to 3.6V Interface Type: Serial, 2 / 3 Wire Supply Current: 14.9mA
X1 = Passives:CRYSTAL-12MHZ; PN: LFXTAL035293REEL
XC6210 = ICs:XC6210: 3.3v Voltage Regulator The XC6210 series are precise, low noise, high current, positive voltage low dropout regulators. They are fabricated using Torex’s CMOS process. The series features a voltage reference, an error amplifier, a current limiter, and a phase compensation circuit plus a driver transistor. With a low ON resistance driver transistor built into, batteries can be used until input-output voltage differential is minimal and can accordingly be used for a longer time.

## Net classes
0 default: width 0.25 mm, drill 0.51 mm
1 5V: width 0.55 mm, drill 0.51 mm
2 3.3V: width 0.22 mm, drill 0.51 mm
3 VIN: width 0.3 mm, drill 0.51 mm
4 Data: width 0.25 mm, drill 0.51 mm
5 MCU_Data: width 0.22 mm, drill 0.51 mm
6 USB_5V: width 0.25 mm, drill 0.51 mm
7 MCU_3V3: width 0.22 mm, drill 0.51 mm